# EAGLE design max6_breakout_lcv2 (EAGLE 6.1)
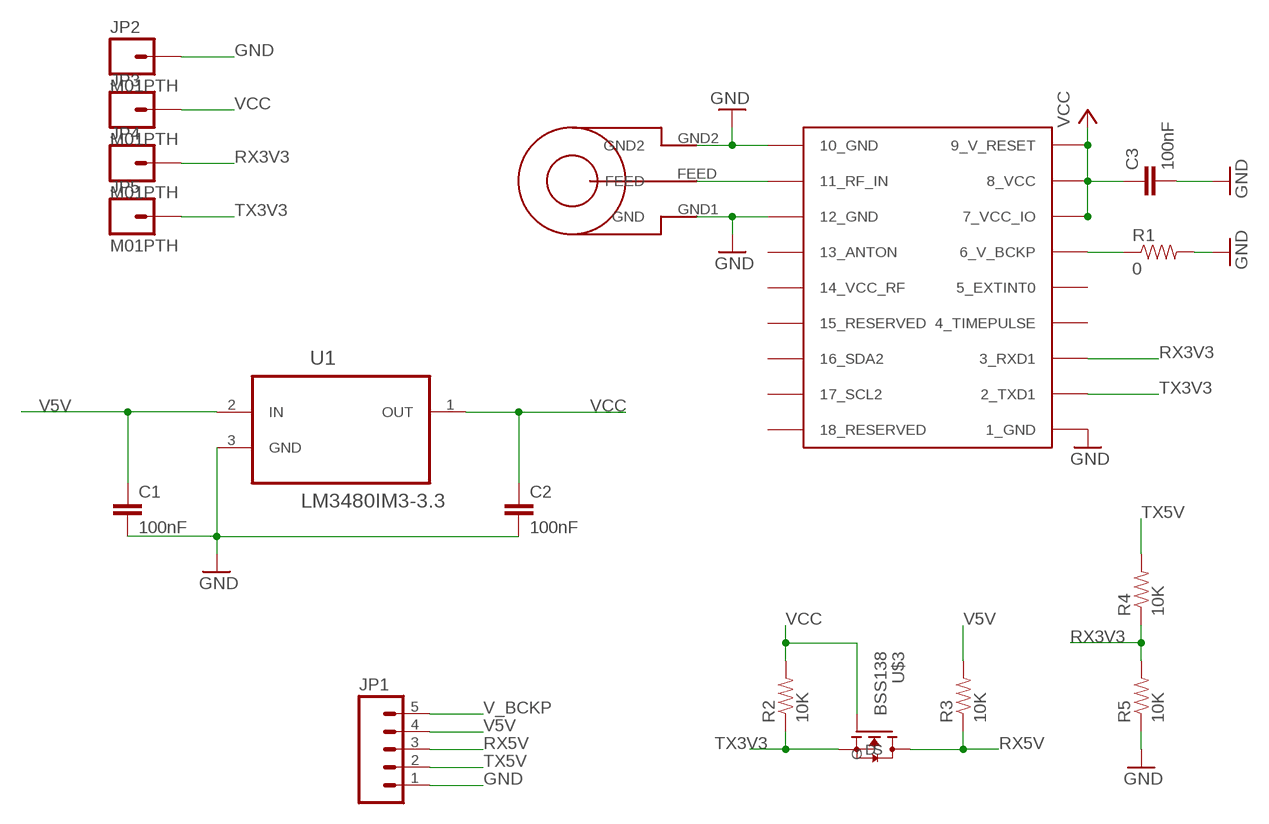
[diagram p0: schematic, sheet 1]

## Parts
C1  100nF  CAP0603-CAP  [0603-CAP]
C2  100nF  CAP0603-CAP  [0603-CAP]
C3  100nF  CAP0603-CAP  [0603-CAP]
JP1  M05PTH  [1X05]
JP2  M01PTH  [1X01]
JP3  M01PTH  [1X01]
JP4  M01PTH  [1X01]
JP5  M01PTH  [1X01]
R1  0  RESISTOR0603-RES  [0603-RES]
R2  10K  RESISTOR0603-RES  [0603-RES]
R3  10K  RESISTOR0603-RES  [0603-RES]
R4  10K  RESISTOR0603-RES  [0603-RES]
R5  10K  RESISTOR0603-RES  [0603-RES]
U1  LM3480IM3-3.3  [SOT95P251X112-3N]
U$1  UBLOX_MAX-6  [UBLOX_MAX-6]
U$2  SARANTEL-SR1202  [SARANTEL-SR1202]
U$3  BSS138  [BSS138]

## Nets
GND: C1.2 C2.2 C3.2 JP1.1 JP2.1 R1.2 R5.1 U1.3(GND) U$1.1_GND U$1.10_GND U$1.12_GND U$2.GND1(GND) U$2.GND2
N$2: U$1.11_RF_IN U$2.FEED
RX3V3: JP4.1 R4.1 R5.2 U$1.3_RXD1
RX5V: JP1.3 R3.1 U$3.D
TX3V3: JP5.1 R2.1 U$1.2_TXD1 U$3.S
TX5V: JP1.2 R4.2
V5V: C1.1 JP1.4 R3.2 U1.2(IN)
V_BCKP: JP1.5 R1.1 U$1.6_V_BCKP
VCC: C2.1 C3.1 JP3.1 R2.2 U1.1(OUT) U$1.7_VCC_IO U$1.8_VCC U$1.9_V_RESET U$3.G
Unconnected: U$1.4_TIMEPULSE U$1.5_EXTINT0 U$1.13_ANTON U$1.14_VCC_RF U$1.15_RESERVED U$1.16_SDA2 U$1.17_SCL2 U$1.18_RESERVED

## Library data of the parts
C1-C3 = SparkFun:CAP: Capacitor Standard 0603 ceramic capacitor, and 0.1" leaded capacitor.
JP1 = SparkFun:M05: Header 5 Standard 5-pin 0.1" header. Use with straight break away headers (SKU : PRT-00116), right angle break away headers (PRT-00553), swiss pins (PRT-00743), machine pins (PRT-00117), and female headers (PRT-00115). Molex polarized connector foot print use with SKU : PRT-08230 with associated crimp pins and housings.
JP2-JP5 = SparkFun:M01: Header 1 Standard 1-pin 0.1" header. Use with straight break away headers (SKU : PRT-00116), right angle break away headers (PRT-00553), swiss pins (PRT-00743), machine pins (PRT-00117), and female headers (PRT-00115).
R1-R5 = SparkFun:RESISTOR: Resistor Basic schematic elements and footprints for 0603, 1206, and PTH resistors.
U1 = Ava:LM3480IM3-3.3: Low-Dropout Linear Voltage; MPN: LM3480IM3-3.3; OC_FARNELL: 1469102; OC_NEWARK: 41K4825; PACKAGE: SOT-3; SUPPLIER: National Semiconductor
U$1 = Ava:UBLOX_MAX-6: UBLOX MAX-6
U$2 = Ava:SARANTEL-SR1202: SARANTEL-SL1202 Author Anthony Stirk / http://ava.upuaut.net Data Sheet : http://docs-europe.electrocomponents.com/webdocs/0dbd/0900766b80dbde80.pdf
U$3 = Ava:BSS138: BSS138 N-Channel Logic Level Enhancement Mode Field Effect Transistor

## Net classes
0 default: width 0.203 mm

## Board
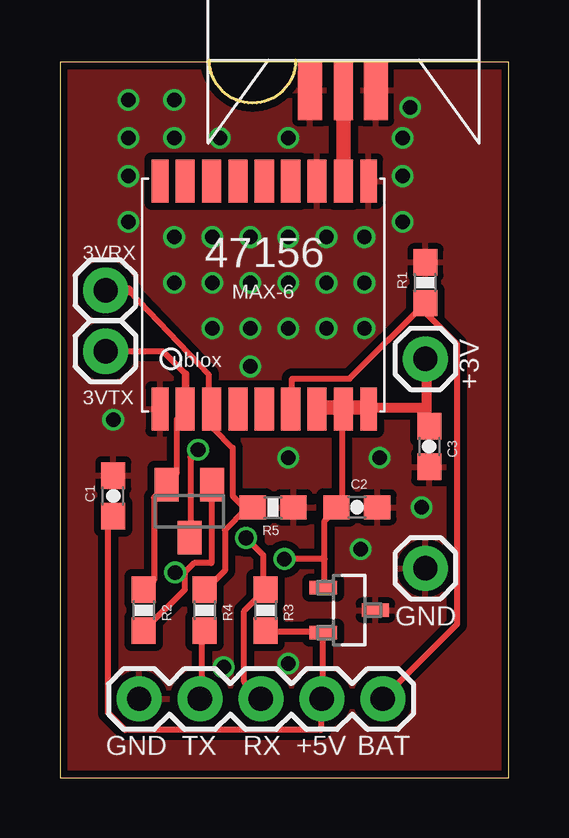
[diagram p1: board, top side]
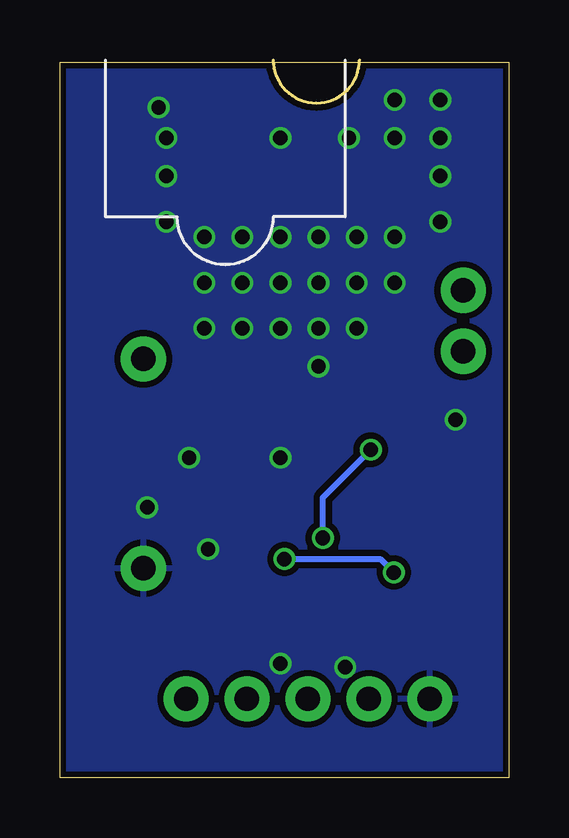
[diagram p2: board, bottom side, seen from below]

Size 18.72 x 29.84 mm. Coordinates in mm from the lower left corner, seen from the top.
Outline: 0,0 18.72,0 18.72,29.84 0,29.84 0,0
Copper layers (1*16): Top 0.035mm / dielectric 1.5mm / Bottom 0.035mm
Design rules: minimum track width 6mil, minimum drill 12mil, track to track 6mil, track to pad 6mil, pad to pad 6mil, via to via 6mil, smd to smd 0mil, copper to edge 10mil, drill to drill 10mil, minimum pad ring 10mil, minimum via ring 6mil, stop-mask expansion 2mil, vias tented up to drill 100mil, thermal gap 10mil

### Footprints (pad centres in the part's own frame; a part is rotated, then mirrored left to right if it is on the bottom)
0603-CAP = smd 1.1 x 1: 1 -0.85,0; 2 0.85,0
1X05 = drill 1.016 pad 1.88: 1 0,0; 2 2.54,0; 3 5.08,0; 4 7.62,0; 5 10.16,0
1X01 = drill 1.016 pad 1.88: 1 0,0
0603-RES = smd 1.1 x 1: 1 -0.85,0; 2 0.85,0
SOT95P251X112-3N = smd 0.559 x 1.143: 1 -0.94,-1.092; 2 0.94,-1.092; 3 0,1.092
UBLOX_MAX-6 = smd 1.8 x 0.7: 1_GND 4.95,-4.4; 9_V_RESET 4.95,4.3; 10_GND -4.55,4.3; 18_RESERVED -4.55,-4.4 | smd 1.8 x 0.8: 2_TXD1 4.95,-3.35; 3_RXD1 4.95,-2.25; 4_TIMEPULSE 4.95,-1.15; 5_EXTINT0 4.95,-0.05; 6_V_BCKP 4.95,1.05; 7_VCC_IO 4.95,2.15; 8_VCC 4.95,3.25; 11_RF_IN -4.55,3.25; 12_GND -4.55,2.15; 13_ANTON -4.55,1.05; 14_VCC_RF -4.55,-0.05; 15_RESERVED -4.55,-1.15; 16_SDA2 -4.55,-2.25; 17_SCL2 -4.55,-3.35
SARANTEL-SR1202 = smd 2.5 x 0.8: FEED 0,0 | smd 2.5 x 1: GND1 0,1.4; GND2 0,-1.35
BSS138 = smd 1 x 1.4: D 0,1.1; G -0.95,-1.1; S 0.95,-1.1

### Placement (x,y rotation side)
C1  2.22,11.75 90 top
C2  12.38,11.27 0 top
C3  15.4,13.81 270 top
JP1  3.3,3.29 0 top
JP2  15.24,8.73 0 top
JP3  15.24,17.46 0 top
JP4  1.91,20.32 0 top
JP5  1.91,17.78 0 top
R1  15.24,20.64 90 top
R2  3.49,6.98 270 top
R3  8.57,6.98 270 top
R4  6.03,6.98 270 top
R5  8.89,11.27 180 top
U1  12.06,6.98 270 top
U$1  8.57,20.32 270 top
U$2  11.83,28.65 90 top
U$3  5.4,11.11 180 top

### Tracks (layer width: path | path; a pad name or v marks a point on that pad's centre or on a via)
GND  (via drill 0.6)
  other vias: 9.53,13.34 13.34,13.34 15.08,11.27 12.54,9.52 9.53,4.76 6.83,4.6 4.76,20.64 4.76,22.54 6.35,20.64 6.35,22.54 7.94,22.54 7.94,20.64 9.53,20.64 9.53,22.54 11.11,22.54 11.11,20.64 12.7,20.64 12.7,22.54 7.94,18.73 9.53,18.73 11.11,18.73 2.22,14.92 9.53,26.67 14.29,26.67 14.61,27.94 6.67,26.67 4.76,26.67 2.86,26.67 2.86,25.08 2.86,23.18 4.76,28.26 2.86,28.26 14.29,25.08 14.29,23.18 6.35,18.73 12.7,18.73 7.94,17.15
  pour Bottom (isolate 0.254): 0.08,29.73 19.9,29.73 19.9,29 19.9,-0.34 0.08,-0.34 0.08,-0.26 0,-0.26 0,29.9
  pour Top (isolate 0.305): 0.08,29.73 19.9,29.73 19.9,29 19.9,-0.34 0.08,-0.34 0.08,-0.26 0,-0.26 0,29.9
N$2
  Top 0.406: 11.83,25.01 11.75,24.92 11.77,24.92 U$1.11_RF_IN
  Top 0.61: U$2.FEED 11.83,25.01
RX3V3
  Top 0.254: 2.86,20.32 6.19,16.83 6.19,15.5 | R4.1 6.08,7.84 6.88,8.63 6.88,10.31 7.76,11.2 8,11.2 R5.2 7.68,11.27 7.2,11.76 7.2,13.76 6.4,14.55 6.4,15.2 U$1.3_RXD1
  Top 0.406: JP4.1 2.86,20.32 | 6.19,15.5 U$1.3_RXD1
RX5V  (via drill 0.61)
  Top 0.254: JP1.3 8.32,3.36 7.68,3.99 7.68,6.95 R3.1 8.48,7.91 8.48,9.27 v7.76,9.99 | v5.76,13.68 5.44,13.36 5.44,10.08 U$3.D
  Bottom 0.254: v5.76,13.68 7.76,11.68 v7.76,9.99
TX3V3
  Top 0.254: JP5.1 4.29,17.78 5.24,16.83 | 5.24,15.43 5.28,15.43 U$1.2_TXD1 5.2,15.27 4.88,14.96 4.88,12.72 4.48,12.31 U$3.S 4.4,12.16 3.92,11.68 3.92,8.23 3.52,7.84 R2.1
  Top 0.305: 5.24,16.83 5.24,15.43 5.24,15.4
TX5V
  Top 0.254: R4.2 6,6.08 5.92,5.99 5.92,3.36 JP1.2
V5V
  Top 0.254: R3.2 8.64,6.08 10.96,6.08 U1.2 10.96,5.91 10.96,3.36 JP1.4 10.88,3.27 10.88,1.99 2.72,1.99 2,2.72 2,10.72 2.16,10.88 C1.1
V_BCKP
  Top 0.254: U$1.6_V_BCKP 9.68,15.43 9.68,16.63 12.08,16.63 15.2,19.76 R1.1 15.12,19.52 16.56,18.07 16.56,6.4 13.52,3.36 JP1.5
VCC  (via drill 0.61)
  Top 0.254: 5.2,8.55 5.2,7.84 3.52,6.16 R2.2 | 5.2,8.55 5.6,8.95 6.32,8.95 6.32,12.16 U$3.G | 15.28,14.79 15.36,14.71 C3.1 | 15.28,17.43 JP3.1 | 11.04,9.12 11.04,7.99 U1.1 | 11.04,9.12 11.04,10.72 11.52,11.2 C2.1 11.6,11.36 11.76,11.52 11.76,15.27 U$1.8_VCC | 10.8,15.43 U$1.7_VCC_IO | 11.76,15.43 U$1.8_VCC | 12.8,15.43 U$1.9_V_RESET 12.96,15.43 | 11.92,15.43 U$1.8_VCC | v4.8,8.55 5.2,8.55 | 11.04,9.12 v9.36,9.12
  Top 0.406: 15.28,17.43 15.28,15.43 | 15.28,15.43 15.28,14.79 | 12.96,15.43 15.28,15.43
  Top 0.61: 11.76,15.43 10.8,15.43 | 11.92,15.43 12.8,15.43
  Bottom 0.254: v4.8,8.55 5.36,9.12 v9.36,9.12

### Text on the board
tPlace: 3VRX | 47156 | 3VTX | +3V | GND | GND | TX | RX | +5V | BAT